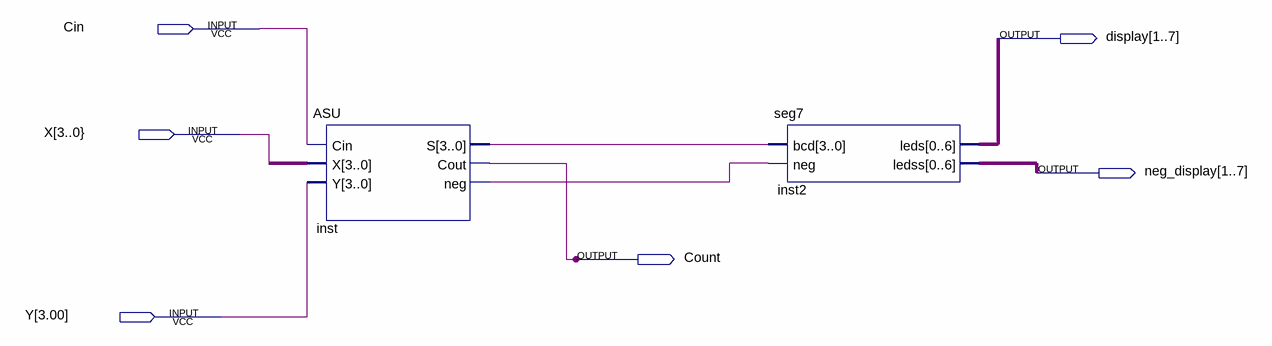
[diagram p0: schematic sheet]
// Quartus schematic circuit 1.bdf as structural Verilog: 2 symbols, 6 pins
module \circuit_1  (
  input  Cin,
  input  \X[3..0} ,
  input  \Y[3.00] ,
  output [1:7] display,
  output [1:7] neg_display,
  output Count
);

  wire inst_neg;
  wire [3:0] inst_s, undriven;

  ASU inst (.Cin(Cin), .X(undriven), .Y({4{\Y[3.00] }}), .S(inst_s), .Cout(Count), .neg(inst_neg));
  seg7 inst2 (.bcd(inst_s), .neg(inst_neg), .leds(display), .ledss(neg_display));
endmodule
